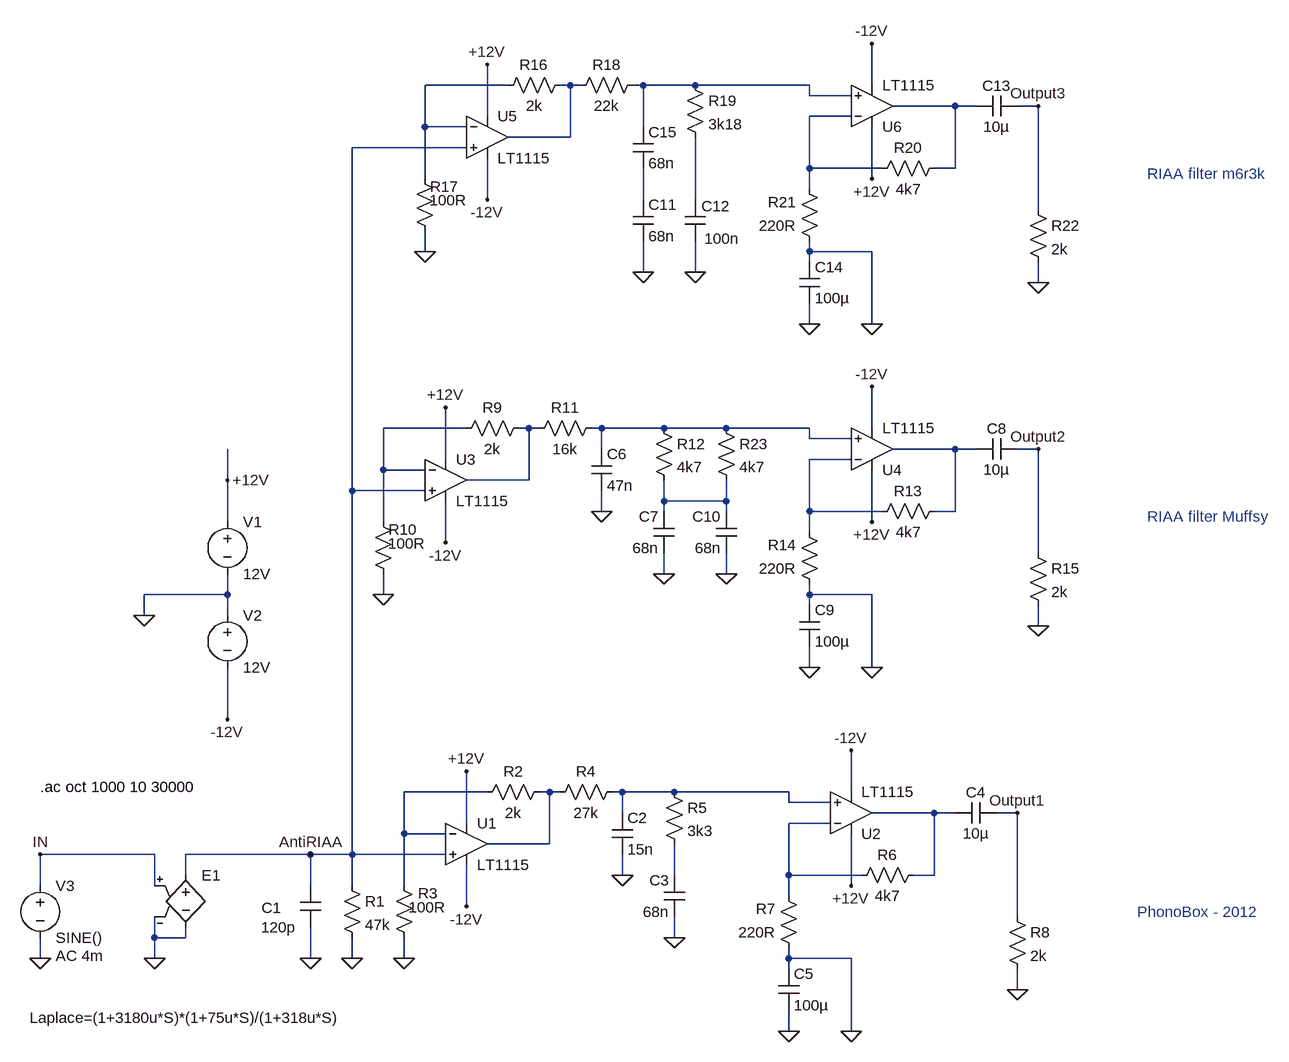
[diagram p0: schematic PreAMP.asc]
PreAMP.asc, the LTspice schematic file:
Version 4
SHEET 1 1808 1008
WIRE 368 -1008 240 -1008
WIRE 464 -1008 448 -1008
WIRE 480 -1008 464 -1008
WIRE 576 -1008 560 -1008
WIRE 656 -1008 576 -1008
WIRE 832 -1008 656 -1008
WIRE 928 -1008 928 -1072
WIRE 832 -992 832 -1008
WIRE 896 -992 832 -992
WIRE 1056 -976 960 -976
WIRE 1088 -976 1056 -976
WIRE 1184 -976 1152 -976
WIRE 336 -960 336 -1040
WIRE 896 -960 832 -960
WIRE 240 -944 240 -1008
WIRE 304 -944 240 -944
WIRE 576 -944 576 -1008
WIRE 464 -928 464 -1008
WIRE 464 -928 368 -928
WIRE 304 -912 128 -912
WIRE 832 -880 832 -960
WIRE 944 -880 832 -880
WIRE 1056 -880 1056 -976
WIRE 1056 -880 1024 -880
WIRE 240 -864 240 -944
WIRE 928 -864 928 -944
WIRE 832 -848 832 -880
WIRE 336 -832 336 -896
WIRE 576 -832 576 -880
WIRE 656 -832 656 -928
WIRE 1184 -816 1184 -976
WIRE 240 -752 240 -784
WIRE 832 -752 832 -768
WIRE 928 -752 832 -752
WIRE 832 -736 832 -752
WIRE 576 -720 576 -768
WIRE 656 -720 656 -768
WIRE 1184 -704 1184 -736
WIRE 832 -640 832 -672
WIRE 928 -640 928 -752
WIRE 304 -480 176 -480
WIRE 400 -480 384 -480
WIRE 416 -480 400 -480
WIRE 512 -480 496 -480
WIRE 608 -480 512 -480
WIRE 704 -480 608 -480
WIRE 832 -480 704 -480
WIRE 928 -480 928 -544
WIRE 832 -464 832 -480
WIRE 896 -464 832 -464
WIRE 512 -448 512 -480
WIRE 1056 -448 960 -448
WIRE 1088 -448 1056 -448
WIRE 1184 -448 1152 -448
WIRE 272 -432 272 -512
WIRE 896 -432 832 -432
WIRE 176 -416 176 -480
WIRE 240 -416 176 -416
WIRE -64 -400 -64 -448
WIRE 400 -400 400 -480
WIRE 400 -400 304 -400
WIRE 128 -384 128 -912
WIRE 240 -384 128 -384
WIRE 608 -368 608 -400
WIRE 704 -368 704 -400
WIRE 704 -368 608 -368
WIRE 512 -352 512 -384
WIRE 608 -352 608 -368
WIRE 704 -352 704 -368
WIRE 832 -352 832 -432
WIRE 944 -352 832 -352
WIRE 1056 -352 1056 -448
WIRE 1056 -352 1024 -352
WIRE -64 -336 -64 -400
WIRE 176 -336 176 -416
WIRE 928 -336 928 -416
WIRE 832 -320 832 -352
WIRE 272 -304 272 -368
WIRE 1184 -288 1184 -448
WIRE 608 -256 608 -288
WIRE 704 -256 704 -288
WIRE -64 -224 -64 -256
WIRE -64 -224 -192 -224
WIRE 176 -224 176 -256
WIRE 832 -224 832 -240
WIRE 928 -224 832 -224
WIRE 832 -208 832 -224
WIRE -192 -192 -192 -224
WIRE -64 -192 -64 -224
WIRE 1184 -176 1184 -208
WIRE 832 -112 832 -144
WIRE 928 -112 928 -224
WIRE -64 -32 -64 -112
WIRE 336 80 208 80
WIRE 432 80 416 80
WIRE 448 80 432 80
WIRE 544 80 528 80
WIRE 624 80 544 80
WIRE 800 80 624 80
WIRE 896 80 896 16
WIRE 800 96 800 80
WIRE 864 96 800 96
WIRE 544 112 544 80
WIRE 1024 112 928 112
WIRE 1056 112 1024 112
WIRE 1152 112 1120 112
WIRE 304 128 304 48
WIRE 864 128 800 128
WIRE 208 144 208 80
WIRE 272 144 208 144
WIRE 432 160 432 80
WIRE 432 160 336 160
WIRE -176 176 -352 176
WIRE 64 176 -128 176
WIRE 128 176 128 -384
WIRE 128 176 64 176
WIRE 272 176 128 176
WIRE -128 208 -128 176
WIRE 544 208 544 176
WIRE 624 208 624 160
WIRE 800 208 800 128
WIRE 912 208 800 208
WIRE 1024 208 1024 112
WIRE 1024 208 992 208
WIRE -352 224 -352 176
WIRE -176 224 -176 176
WIRE 64 224 64 176
WIRE 128 224 128 176
WIRE 208 224 208 144
WIRE 896 224 896 144
WIRE 800 240 800 208
WIRE 304 256 304 192
WIRE 1152 272 1152 112
WIRE -176 304 -176 272
WIRE -128 304 -128 288
WIRE -128 304 -176 304
WIRE 624 304 624 272
WIRE -352 336 -352 304
WIRE -176 336 -176 304
WIRE 64 336 64 288
WIRE 128 336 128 304
WIRE 208 336 208 304
WIRE 800 336 800 320
WIRE 896 336 800 336
WIRE 800 352 800 336
WIRE 1152 384 1152 352
WIRE 800 448 800 416
WIRE 896 448 896 336
FLAG 304 256 -12V
FLAG 896 16 -12V
FLAG 304 48 +12V
FLAG 896 224 +12V
FLAG 64 336 0
FLAG 128 336 0
FLAG 208 336 0
FLAG 544 208 0
FLAG 624 304 0
FLAG 800 448 0
FLAG 1152 384 0
FLAG -64 -400 +12V
FLAG -192 -192 0
FLAG -64 -32 -12V
FLAG 64 176 AntiRIAA
FLAG 1152 112 Output1
FLAG -352 336 0
FLAG 896 448 0
FLAG 272 -304 -12V
FLAG 928 -544 -12V
FLAG 272 -512 +12V
FLAG 928 -336 +12V
FLAG 176 -224 0
FLAG 512 -352 0
FLAG 608 -256 0
FLAG 832 -112 0
FLAG 1184 -176 0
FLAG 1184 -448 Output2
FLAG 928 -112 0
FLAG 704 -256 0
FLAG 336 -832 -12V
FLAG 928 -1072 -12V
FLAG 336 -1040 +12V
FLAG 928 -864 +12V
FLAG 240 -752 0
FLAG 576 -720 0
FLAG 656 -720 0
FLAG 832 -640 0
FLAG 1184 -704 0
FLAG 1184 -976 Output3
FLAG 928 -640 0
FLAG -176 336 0
FLAG -352 176 IN
SYMBOL cap 48 224 R0
WINDOW 0 -59 34 Left 2
WINDOW 3 -60 64 Left 2
SYMATTR InstName C1
SYMATTR Value 120p
SYMBOL res 112 208 R0
SYMATTR InstName R1
SYMATTR Value 47k
SYMBOL OpAmps\\LT1115 304 96 R0
SYMATTR InstName U1
SYMBOL OpAmps\\LT1115 896 176 M180
SYMATTR InstName U2
SYMBOL res 432 64 R90
WINDOW 0 0 56 VBottom 2
WINDOW 3 32 56 VTop 2
SYMATTR InstName R2
SYMATTR Value 2k
SYMBOL res 224 320 R180
WINDOW 0 -36 84 Left 2
WINDOW 3 9 63 Right 2
SYMATTR InstName R3
SYMATTR Value 100R
SYMBOL res 544 64 R90
WINDOW 0 0 56 VBottom 2
WINDOW 3 32 56 VTop 2
SYMATTR InstName R4
SYMATTR Value 27k
SYMBOL cap 528 112 R0
SYMATTR InstName C2
SYMATTR Value 15n
SYMBOL cap 640 272 R180
WINDOW 0 24 56 Left 2
WINDOW 3 24 8 Left 2
SYMATTR InstName C3
SYMATTR Value 68n
SYMBOL res 608 64 R0
SYMATTR InstName R5
SYMATTR Value 3k3
SYMBOL cap 1120 96 R90
WINDOW 0 0 32 VBottom 2
WINDOW 3 32 32 VTop 2
SYMATTR InstName C4
SYMATTR Value 10µ
SYMBOL res 1008 192 R90
WINDOW 0 0 56 VBottom 2
WINDOW 3 32 56 VTop 2
SYMATTR InstName R6
SYMATTR Value 4k7
SYMBOL res 816 336 R180
WINDOW 0 36 76 Left 2
WINDOW 3 36 40 Left 2
SYMATTR InstName R7
SYMATTR Value 220R
SYMBOL cap 784 352 R0
SYMATTR InstName C5
SYMATTR Value 100µ
SYMBOL res 1136 256 R0
SYMATTR InstName R8
SYMATTR Value 2k
SYMBOL voltage -64 -352 R0
WINDOW 123 0 0 Left 0
WINDOW 39 0 0 Left 0
SYMATTR InstName V1
SYMATTR Value 12V
SYMBOL voltage -64 -208 R0
WINDOW 123 0 0 Left 0
WINDOW 39 0 0 Left 0
SYMATTR InstName V2
SYMATTR Value 12V
SYMBOL voltage -352 208 R0
WINDOW 123 24 124 Left 2
WINDOW 39 0 0 Left 0
SYMATTR Value2 AC 4m
SYMATTR InstName V3
SYMATTR Value SINE()
SYMBOL OpAmps\\LT1115 272 -464 R0
SYMATTR InstName U3
SYMBOL OpAmps\\LT1115 928 -384 M180
SYMATTR InstName U4
SYMBOL res 400 -496 R90
WINDOW 0 0 56 VBottom 2
WINDOW 3 32 56 VTop 2
SYMATTR InstName R9
SYMATTR Value 2k
SYMBOL res 192 -240 R180
WINDOW 0 -36 84 Left 2
WINDOW 3 9 63 Right 2
SYMATTR InstName R10
SYMATTR Value 100R
SYMBOL res 512 -496 R90
WINDOW 0 0 56 VBottom 2
WINDOW 3 32 56 VTop 2
SYMATTR InstName R11
SYMATTR Value 16k
SYMBOL cap 496 -448 R0
SYMATTR InstName C6
SYMATTR Value 47n
SYMBOL cap 624 -288 R180
WINDOW 0 24 56 Left 2
WINDOW 3 24 8 Left 2
SYMATTR InstName C7
SYMATTR Value 68n
SYMBOL res 592 -496 R0
SYMATTR InstName R12
SYMATTR Value 4k7
SYMBOL cap 1152 -464 R90
WINDOW 0 0 32 VBottom 2
WINDOW 3 32 32 VTop 2
SYMATTR InstName C8
SYMATTR Value 10µ
SYMBOL res 1040 -368 R90
WINDOW 0 0 56 VBottom 2
WINDOW 3 32 56 VTop 2
SYMATTR InstName R13
SYMATTR Value 4k7
SYMBOL res 848 -224 R180
WINDOW 0 36 76 Left 2
WINDOW 3 36 40 Left 2
SYMATTR InstName R14
SYMATTR Value 220R
SYMBOL cap 816 -208 R0
SYMATTR InstName C9
SYMATTR Value 100µ
SYMBOL res 1168 -304 R0
SYMATTR InstName R15
SYMATTR Value 2k
SYMBOL cap 720 -288 R180
WINDOW 0 24 56 Left 2
WINDOW 3 24 8 Left 2
SYMATTR InstName C10
SYMATTR Value 68n
SYMBOL OpAmps\\LT1115 336 -992 R0
SYMATTR InstName U5
SYMBOL OpAmps\\LT1115 928 -912 M180
SYMATTR InstName U6
SYMBOL res 464 -1024 R90
WINDOW 0 0 56 VBottom 2
WINDOW 3 32 56 VTop 2
SYMATTR InstName R16
SYMATTR Value 2k
SYMBOL res 256 -768 R180
WINDOW 0 -36 84 Left 2
WINDOW 3 9 63 Right 2
SYMATTR InstName R17
SYMATTR Value 100R
SYMBOL res 576 -1024 R90
WINDOW 0 0 56 VBottom 2
WINDOW 3 32 56 VTop 2
SYMATTR InstName R18
SYMATTR Value 22k
SYMBOL cap 560 -832 R0
SYMATTR InstName C11
SYMATTR Value 68n
SYMBOL cap 672 -768 R180
WINDOW 0 -38 54 Left 2
WINDOW 3 -52 4 Left 2
SYMATTR InstName C12
SYMATTR Value 100n
SYMBOL res 640 -1024 R0
SYMATTR InstName R19
SYMATTR Value 3k18
SYMBOL cap 1152 -992 R90
WINDOW 0 0 32 VBottom 2
WINDOW 3 32 32 VTop 2
SYMATTR InstName C13
SYMATTR Value 10µ
SYMBOL res 1040 -896 R90
WINDOW 0 0 56 VBottom 2
WINDOW 3 32 56 VTop 2
SYMATTR InstName R20
SYMATTR Value 4k7
SYMBOL res 848 -752 R180
WINDOW 0 36 76 Left 2
WINDOW 3 36 40 Left 2
SYMATTR InstName R21
SYMATTR Value 220R
SYMBOL cap 816 -736 R0
SYMATTR InstName C14
SYMATTR Value 100µ
SYMBOL res 1168 -832 R0
SYMATTR InstName R22
SYMATTR Value 2k
SYMBOL e -128 192 R0
WINDOW 3 -240 235 Left 2
SYMATTR InstName E1
SYMATTR Value Laplace=(1+3180u*S)*(1+75u*S)/(1+318u*S)
SYMBOL res 688 -496 R0
SYMATTR InstName R23
SYMATTR Value 4k7
SYMBOL cap 560 -944 R0
SYMATTR InstName C15
SYMATTR Value 68n
TEXT -352 72 Left 2 !.ac oct 1000 10 30000
TEXT 1336 264 Left 2 ;PhonoBox - 2012
TEXT 1352 -344 Left 2 ;RIAA filter Muffsy
TEXT 1352 -872 Left 2 ;RIAA filter m6r3k

The netlist it stands for:
* PreAMP.asc
C1 AntiRIAA 0 120p
R1 AntiRIAA 0 47k
XU1 AntiRIAA N014 +12V -12V N015 LT1028  ; LT1115, pins In+ In- V+ V- OUT
XU2 N016 N018 +12V -12V N017 LT1028  ; LT1115, pins In+ In- V+ V- OUT
R2 N015 N014 2k
R3 0 N014 100R
R4 N016 N015 27k
C2 N016 0 15n
C3 0 N019 68n
R5 N016 N019 3k3
C4 Output1 N017 10µ
R6 N017 N018 4k7
R7 0 N018 220R
C5 0 0 100µ
R8 Output1 0 2k
V1 +12V 0 12V
V2 0 -12V 12V
V3 IN 0 SINE() AC 4m
XU3 AntiRIAA N008 +12V -12V N009 LT1028  ; LT1115, pins In+ In- V+ V- OUT
XU4 N010 N012 +12V -12V N011 LT1028  ; LT1115, pins In+ In- V+ V- OUT
R9 N009 N008 2k
R10 0 N008 100R
R11 N010 N009 16k
C6 N010 0 47n
C7 0 N013 68n
R12 N010 N013 4k7
C8 Output2 N011 10µ
R13 N011 N012 4k7
R14 0 N012 220R
C9 0 0 100µ
R15 Output2 0 2k
C10 0 N013 68n
XU5 AntiRIAA N001 +12V -12V N002 LT1028  ; LT1115, pins In+ In- V+ V- OUT
XU6 N003 N005 +12V -12V N004 LT1028  ; LT1115, pins In+ In- V+ V- OUT
R16 N002 N001 2k
R17 0 N001 100R
R18 N003 N002 22k
C11 N006 0 68n
C12 0 N007 100n
R19 N003 N007 3k18
C13 Output3 N004 10µ
R20 N004 N005 4k7
R21 0 N005 220R
C14 0 0 100µ
R22 Output3 0 2k
E1 AntiRIAA 0 IN 0 Laplace=(1+3180u*S)*(1+75u*S)/(1+318u*S)
R23 N010 N013 4k7
C15 N003 N006 68n
.ac oct 1000 10 30000
* PhonoBox - 2012
* RIAA filter Muffsy
* RIAA filter m6r3k
.lib LTC.lib
.backanno
.end

* Results of the author's LTspice run, read from the files saved beside the schematic
* Operating Point, zero values left out:
*   V(+12v) = 12 V
*   V(-12v) = -12 V
*   I(V2) = -44.35 mA
*   I(V1) = -44.35 mA